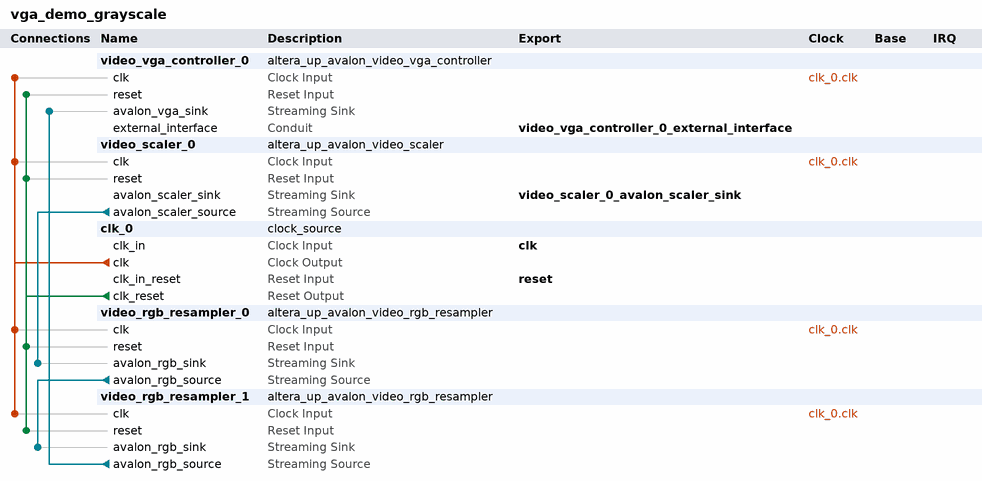
[diagram p0: system contents]
# Platform Designer (Qsys) system vga_demo_grayscale, Cyclone IV E EP4CE115F29C7
# Parameters at their usual value, and those the tool derives, are not listed.
package require -exact qsys 18.0
create_system vga_demo_grayscale
set_project_property DEVICE_FAMILY {Cyclone IV E}
set_project_property DEVICE EP4CE115F29C7

add_instance video_vga_controller_0 altera_up_avalon_video_vga_controller 18.0
set_instance_parameter_value video_vga_controller_0 board DE10-Standard
set_instance_parameter_value video_vga_controller_0 resolution {VGA 640x480}

add_instance video_scaler_0 altera_up_avalon_video_scaler 18.0
set_instance_parameter_value video_scaler_0 color_bits 10
set_instance_parameter_value video_scaler_0 color_planes 3
set_instance_parameter_value video_scaler_0 height_scaling 2
set_instance_parameter_value video_scaler_0 width_in 320
set_instance_parameter_value video_scaler_0 width_scaling 2

add_instance clk_0 clock_source 20.1
set_instance_parameter_value clk_0 clockFrequency 25000000

add_instance video_rgb_resampler_0 altera_up_avalon_video_rgb_resampler 18.0
set_instance_parameter_value video_rgb_resampler_0 alpha 1023
set_instance_parameter_value video_rgb_resampler_0 input_type {30-bit RGB}
set_instance_parameter_value video_rgb_resampler_0 output_type {8-bit Grayscale}

add_instance video_rgb_resampler_1 altera_up_avalon_video_rgb_resampler 18.0
set_instance_parameter_value video_rgb_resampler_1 alpha 1023
set_instance_parameter_value video_rgb_resampler_1 input_type {8-bit Grayscale}
set_instance_parameter_value video_rgb_resampler_1 output_type {30-bit RGB}

# connections
add_connection clk_0.clk video_rgb_resampler_0.clk clock
add_connection clk_0.clk video_rgb_resampler_1.clk clock
add_connection clk_0.clk video_scaler_0.clk clock
add_connection clk_0.clk video_vga_controller_0.clk clock
add_connection clk_0.clk_reset video_rgb_resampler_0.reset reset
add_connection clk_0.clk_reset video_rgb_resampler_1.reset reset
add_connection clk_0.clk_reset video_scaler_0.reset reset
add_connection clk_0.clk_reset video_vga_controller_0.reset reset
add_connection video_rgb_resampler_0.avalon_rgb_source video_rgb_resampler_1.avalon_rgb_sink avalon_streaming
add_connection video_rgb_resampler_1.avalon_rgb_source video_vga_controller_0.avalon_vga_sink avalon_streaming
add_connection video_scaler_0.avalon_scaler_source video_rgb_resampler_0.avalon_rgb_sink avalon_streaming

# exported interfaces
add_interface clk clock sink
set_interface_property clk EXPORT_OF clk_0.clk_in
add_interface reset reset sink
set_interface_property reset EXPORT_OF clk_0.clk_in_reset
add_interface video_scaler_0_avalon_scaler_sink avalon_streaming sink
set_interface_property video_scaler_0_avalon_scaler_sink EXPORT_OF video_scaler_0.avalon_scaler_sink
add_interface video_vga_controller_0_external_interface conduit end
set_interface_property video_vga_controller_0_external_interface EXPORT_OF video_vga_controller_0.external_interface

set_interconnect_requirement {$system} qsys_mm.clockCrossingAdapter HANDSHAKE
set_interconnect_requirement {$system} qsys_mm.enableEccProtection FALSE
set_interconnect_requirement {$system} qsys_mm.insertDefaultSlave FALSE
set_interconnect_requirement {$system} qsys_mm.maxAdditionalLatency 1

save_system vga_demo_grayscale.qsys
